# Altium schematic sheet S6.SchDoc
size A2
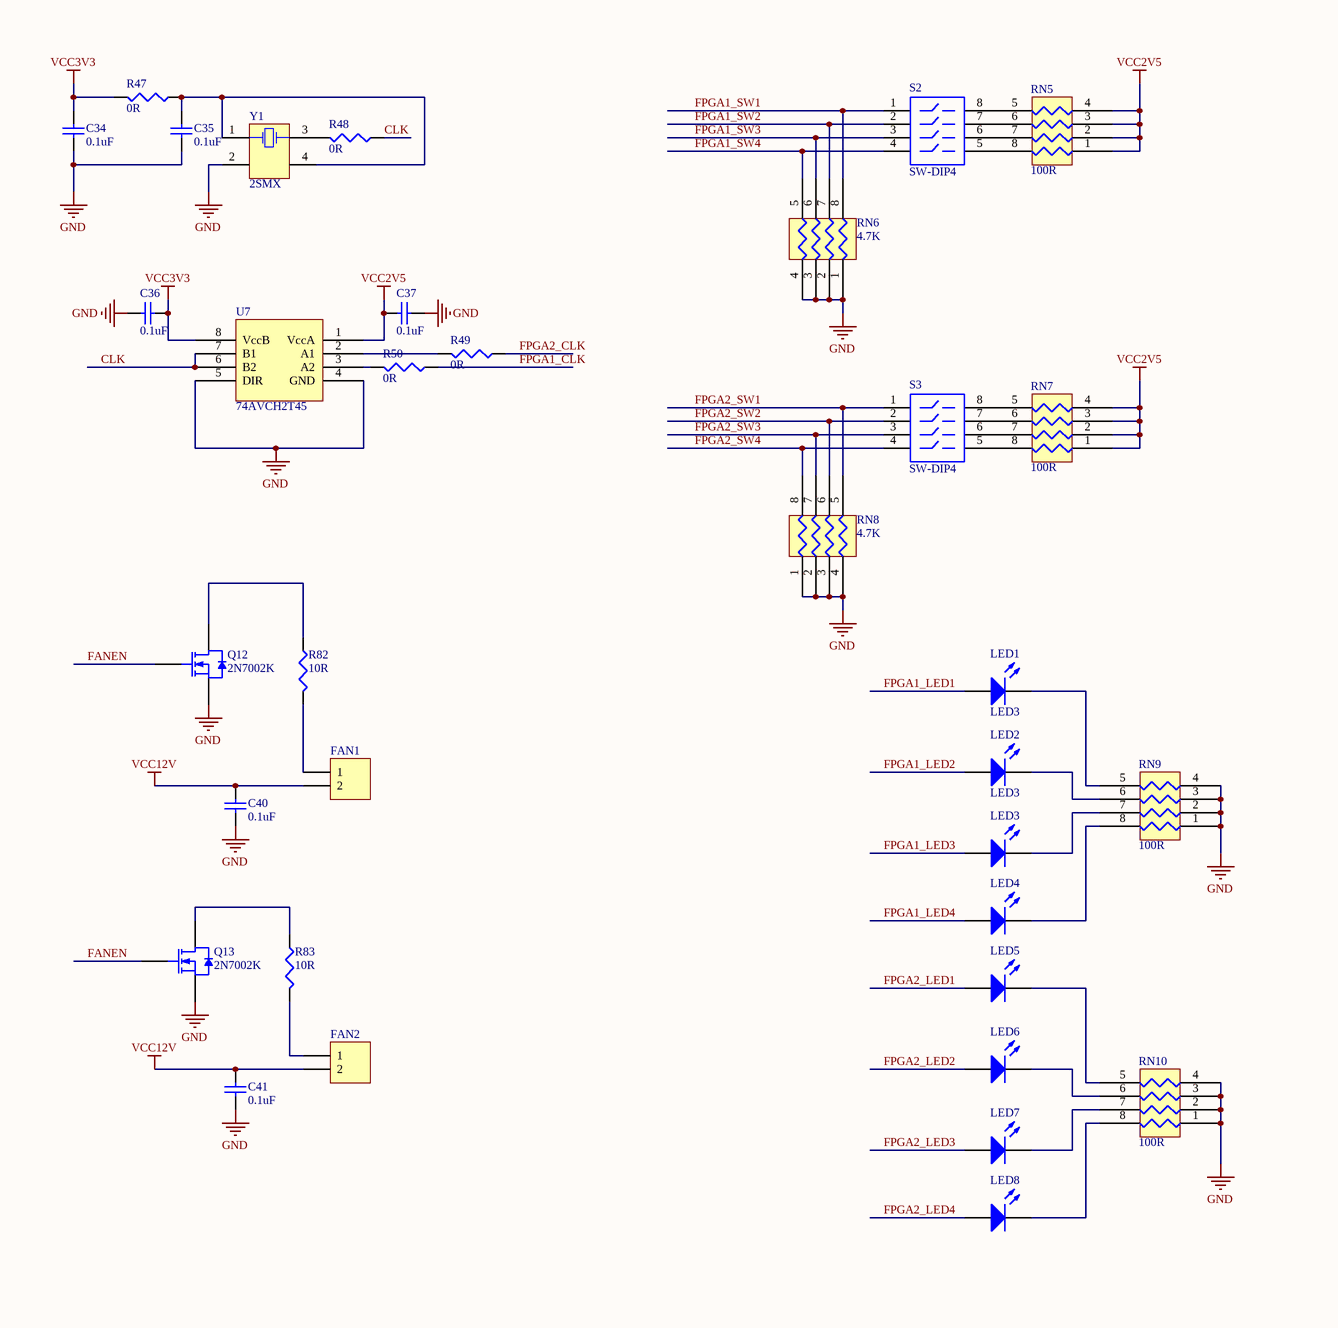
[diagram p0: S6.SchDoc, left]
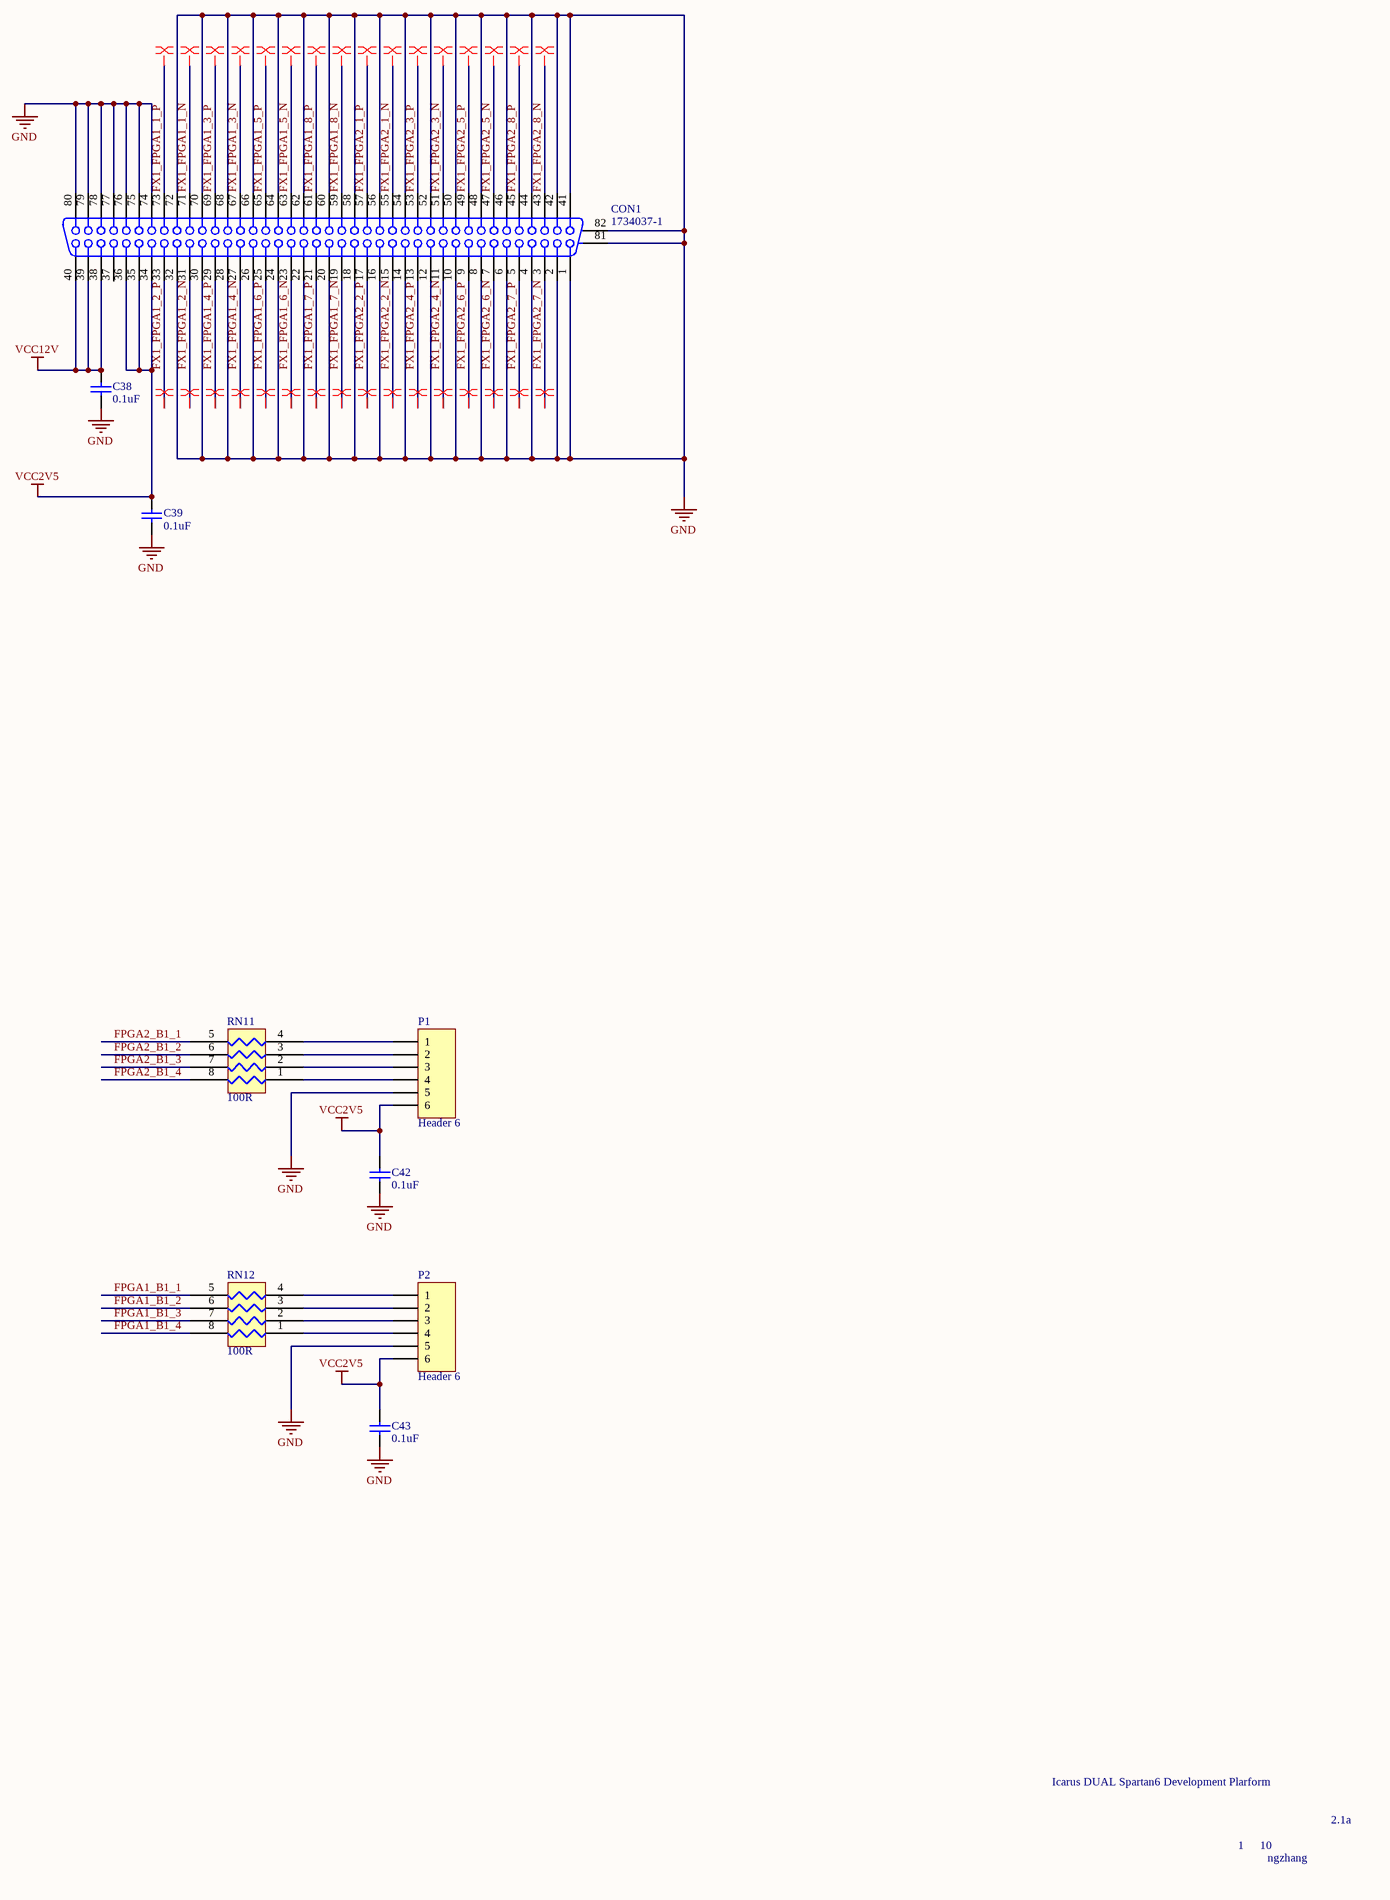
[diagram p1: S6.SchDoc, right]

## Parts
C34  0.1uF  [1608[0603]]
C35  0.1uF  [1608[0603]]
C36  0.1uF  [1608[0603]]
C37  0.1uF  [1608[0603]]
C38  0.1uF  [1608[0603]]
C39  0.1uF  [1608[0603]]
C40  0.1uF  [1608[0603]]
C41  0.1uF  [1608[0603]]
C42  0.1uF  [1608[0603]]
C43  0.1uF  [1608[0603]]
CON1  1734037-1  [1734037-1]
FAN1  Header 2  [2PINFAN]  (value not drawn)
FAN2  Header 2  [2PINFAN]  (value not drawn)
LED1  LED3  [CD1608-0603]
LED2  LED3  [CD1608-0603]
LED3  LED3  [CD1608-0603]  (value not drawn)
LED4  LED3  [CD1608-0603]  (value not drawn)
LED5  LED3  [CD1608-0603]  (value not drawn)
LED6  LED3  [CD1608-0603]  (value not drawn)
LED7  LED3  [CD1608-0603]  (value not drawn)
LED8  LED3  [CD1608-0603]  (value not drawn)
P1  Header 6  [HDR1X6]
P2  Header 6  [HDR1X6]
Q12  2N7002K  [SOT23_N]
Q13  2N7002K  [SOT23_N]
R47  0R  [J1-0603]
R48  0R  [J1-0603]
R49  0R  [J1-0603]
R50  0R  [J1-0603]
R82  10R  [J1-0603]
R83  10R  [J1-0603]
RN5  100R  [EXBV8V]
RN6  4.7K  [EXBV8V]
RN7  100R  [EXBV8V]
RN8  4.7K  [EXBV8V]
RN9  100R  [EXBV8V]
RN10  100R  [EXBV8V]
RN11  100R  [EXBV8V]
RN12  100R  [EXBV8V]
S2  SW-DIP4  [SO8_N]
S3  SW-DIP4  [SO8_N]
U7  74AVCH2T45  [SOT765-1]
Y1  2SMX  [SMX2]

## Nets
GND: C34.1 C35.1 C36.2 C37.1 C38.1 C39.1 C40.2 C41.2 C42.1 C43.1 CON1.1 CON1.2 CON1.4 CON1.6 CON1.8 CON1.10 CON1.12 CON1.14 CON1.16 CON1.18 CON1.20 CON1.22 CON1.24 CON1.26 CON1.28 CON1.30 CON1.32 CON1.41 CON1.42 CON1.44 CON1.46 CON1.48 CON1.50 CON1.52 CON1.54 CON1.56 CON1.58 CON1.60 CON1.62 CON1.64 CON1.66 CON1.68 CON1.70 CON1.72 CON1.74 CON1.75 CON1.76 CON1.77 CON1.78 CON1.79 CON1.80 CON1.81(MH1) CON1.82(MH2) P1.5 P2.5 Q12.2(S) Q13.2(S) RN6.1 RN6.2 RN6.3 RN6.4 RN8.1 RN8.2 RN8.3 RN8.4 RN9.1 RN9.2 RN9.3 RN9.4 RN10.1 RN10.2 RN10.3 RN10.4 U7.4(GND) U7.5(DIR) Y1.2(NC)
VCC2V5: C37.2 C39.2 C42.2 C43.2 CON1.34 CON1.35 CON1.36 P1.6 P2.6 RN5.1 RN5.2 RN5.3 RN5.4 RN7.1 RN7.2 RN7.3 RN7.4 U7.1(VccA)
VCC3V3: C34.2 C36.1 R47.2 U7.8(VccB)
VCC12V: C38.2 C40.1 C41.1 CON1.38 CON1.39 CON1.40 FAN1.2 FAN2.2
CLK: R48.1 U7.6(B2) U7.7(B1)
FANEN: Q12.1(G) Q13.1(G)
FPGA1_B1_1: RN12.5
FPGA1_B1_2: RN12.6
FPGA1_B1_3: RN12.7
FPGA1_B1_4: RN12.8
FPGA1_CLK: R50.1
FPGA1_LED1: LED1.1(A)
FPGA1_LED2: LED2.1(A)
FPGA1_LED3: LED3.1(A)
FPGA1_LED4: LED4.1(A)
FPGA1_SW1: RN6.8 S2.1
FPGA1_SW2: RN6.7 S2.2
FPGA1_SW3: RN6.6 S2.3
FPGA1_SW4: RN6.5 S2.4
FPGA2_B1_1: RN11.5
FPGA2_B1_2: RN11.6
FPGA2_B1_3: RN11.7
FPGA2_B1_4: RN11.8
FPGA2_CLK: R49.1
FPGA2_LED1: LED5.1(A)
FPGA2_LED2: LED6.1(A)
FPGA2_LED3: LED7.1(A)
FPGA2_LED4: LED8.1(A)
FPGA2_SW1: RN8.5 S3.1
FPGA2_SW2: RN8.6 S3.2
FPGA2_SW3: RN8.7 S3.3
FPGA2_SW4: RN8.8 S3.4
FX1_FPGA1_1_N: CON1.71
FX1_FPGA1_1_P: CON1.73
FX1_FPGA1_2_N: CON1.31
FX1_FPGA1_2_P: CON1.33
FX1_FPGA1_3_N: CON1.67
FX1_FPGA1_3_P: CON1.69
FX1_FPGA1_4_N: CON1.27
FX1_FPGA1_4_P: CON1.29
FX1_FPGA1_5_N: CON1.63
FX1_FPGA1_5_P: CON1.65
FX1_FPGA1_6_N: CON1.23
FX1_FPGA1_6_P: CON1.25
FX1_FPGA1_7_N: CON1.19
FX1_FPGA1_7_P: CON1.21
FX1_FPGA1_8_N: CON1.59
FX1_FPGA1_8_P: CON1.61
FX1_FPGA2_1_N: CON1.55
FX1_FPGA2_1_P: CON1.57
FX1_FPGA2_2_N: CON1.15
FX1_FPGA2_2_P: CON1.17
FX1_FPGA2_3_N: CON1.51
FX1_FPGA2_3_P: CON1.53
FX1_FPGA2_4_N: CON1.11
FX1_FPGA2_4_P: CON1.13
FX1_FPGA2_5_N: CON1.47
FX1_FPGA2_5_P: CON1.49
FX1_FPGA2_6_N: CON1.7
FX1_FPGA2_6_P: CON1.9
FX1_FPGA2_7_N: CON1.3
FX1_FPGA2_7_P: CON1.5
FX1_FPGA2_8_N: CON1.43
FX1_FPGA2_8_P: CON1.45
NetC35_2: C35.2 R47.1 Y1.1(OSC1) Y1.4(NC)
NetFAN1_1: FAN1.1 R82.2
NetFAN2_1: FAN2.1 R83.2
NetLED1_2: LED1.2(K) RN9.5
NetLED2_2: LED2.2(K) RN9.6
NetLED3_2: LED3.2(K) RN9.7
NetLED4_2: LED4.2(K) RN9.8
NetLED5_2: LED5.2(K) RN10.5
NetLED6_2: LED6.2(K) RN10.6
NetLED7_2: LED7.2(K) RN10.7
NetLED8_2: LED8.2(K) RN10.8
NetP1_1: P1.1 RN11.4
NetP1_2: P1.2 RN11.3
NetP1_3: P1.3 RN11.2
NetP1_4: P1.4 RN11.1
NetP2_1: P2.1 RN12.4
NetP2_2: P2.2 RN12.3
NetP2_3: P2.3 RN12.2
NetP2_4: P2.4 RN12.1
NetQ12_3: Q12.3(D) R82.1
NetQ13_3: Q13.3(D) R83.1
NetR48_2: R48.2 Y1.3(OSC2)
NetR49_2: R49.2 U7.2(A1)
NetR50_2: R50.2 U7.3(A2)
NetRN5_5: RN5.5 S2.8
NetRN5_6: RN5.6 S2.7
NetRN5_7: RN5.7 S2.6
NetRN5_8: RN5.8 S2.5
NetRN7_5: RN7.5 S3.8
NetRN7_6: RN7.6 S3.7
NetRN7_7: RN7.7 S3.6
NetRN7_8: RN7.8 S3.5

Not connected (* = marked no-connect by the designer): CON1 37

## Layout directives
differential pair: FX1_FPGA1_1_N, FX1_FPGA1_1_P, FX1_FPGA1_2_N, FX1_FPGA1_2_P, FX1_FPGA1_3_N, FX1_FPGA1_3_P, FX1_FPGA1_4_N, FX1_FPGA1_4_P, FX1_FPGA1_5_N, FX1_FPGA1_5_P, FX1_FPGA1_6_N, FX1_FPGA1_6_P, FX1_FPGA1_7_N, FX1_FPGA1_7_P, FX1_FPGA1_8_N, FX1_FPGA1_8_P, FX1_FPGA2_1_N, FX1_FPGA2_1_P, FX1_FPGA2_2_N, FX1_FPGA2_2_P, FX1_FPGA2_3_N, FX1_FPGA2_3_P, FX1_FPGA2_4_N, FX1_FPGA2_4_P, FX1_FPGA2_5_N, FX1_FPGA2_5_P, FX1_FPGA2_6_N, FX1_FPGA2_6_P, FX1_FPGA2_7_N, FX1_FPGA2_7_P, FX1_FPGA2_8_N, FX1_FPGA2_8_P

## Notes on the sheet
- Icarus DUAL Spartan6 Development Plarform
- 1
- 10
- ngzhang
- 2.1a

## Library data of the parts
C34-C43 = Cap Semi: Capacitor (Semiconductor SIM Model); Published: 8-Jun-2000; LatestRevisionDate: 29-May-2009; LatestRevisionNote: IPC-7351 Footprint Added.; PackageReference: C1206; Publisher: Altium Limited; PackageDescription: Chip Capacitor; Value: 0.1uF
FAN1 FAN2 = Header 2: Header, 2-Pin; LatestRevisionDate: 17-Jul-2002; LatestRevisionNote: Re-released for DXP Platform.; Publisher: Altium Limited
LED1-LED8 = LED3: Typical BLUE SiC LED; Published: 8-Jun-2000; LatestRevisionDate: 17-Dec-2003; LatestRevisionNote: PCB Footprint replaced.; DatasheetVersion: 16-Apr-2002; PackageVersion: 16-Apr-2002; PackageReference: 3.5X2.8X1.9; Publisher: Altium Limited; PackageDescription: SM LED; 2 C-Bend Leads; Body 3.5 x 2.8 x 1.9 mm, inc leads (LxWxH typ)
P1 P2 = Header 6: Header, 6-Pin; LatestRevisionDate: 17-Jul-2002; LatestRevisionNote: Re-released for DXP Platform.; Publisher: Altium Limited
Q12 Q13 = 2N7002: N-channel Enhancement Mode Field-effect Transistor; Published: 17-Sep-2003; LatestRevisionDate: 12-Dec-2006; LatestRevisionNote: IPC-7351 Footprint Added.; DatasheetVersion: 27-Jul-2000; PackageVersion: May-1999; PackageReference: SOT23; Publisher: Altium Limited; PackageDescription: 3-Pin SOT-23 Package 0.95 mm Pitch, 2.3 mm Lead Span; ComponentLink1Description: Manufacturer Link; ComponentLink1URL: http://www.semiconductors.philips.com/; ComponentLink2Description: Datasheet; ComponentLink2URL: http://www.semiconductors.philips.com/acrobat/datasheets/2N7002_4.pdf
R47-R50 R82 R83 = Res3: Resistor; Published: 8-Jun-2000; LatestRevisionDate: 29-May-2009; LatestRevisionNote: IPC-7351 Footprint Added.; PackageReference: J1-0603; Publisher: Altium Limited; PackageDescription: Chip Resistor
  R47-R50: Value: 0R
  R82 R83: Value: 10R
RN5-RN12 = RES4PACK
S2 S3 = SW-DIP4: DIP Switch; Published: 24-Mar-1999; LatestRevisionDate: 17-Jul-2002; LatestRevisionNote: Re-released for DXP Platform.; PackageReference: DIP-8; Publisher: Altium Limited
Y1 = 2SMX: Surface Mount Quartz Crystal; Note: PCB layout complies with manufacturer's recommendation.; Published: 17-Jul-2002; DatasheetDocument: 9-Sep-1999; PackageDocument: 9-Sep-1999; PackageReference: 2SMX; Publisher: Altium Limited; ComponentLink1Description: Manufacturer Link; ComponentLink1URL: http://www.cmac.com/mt/